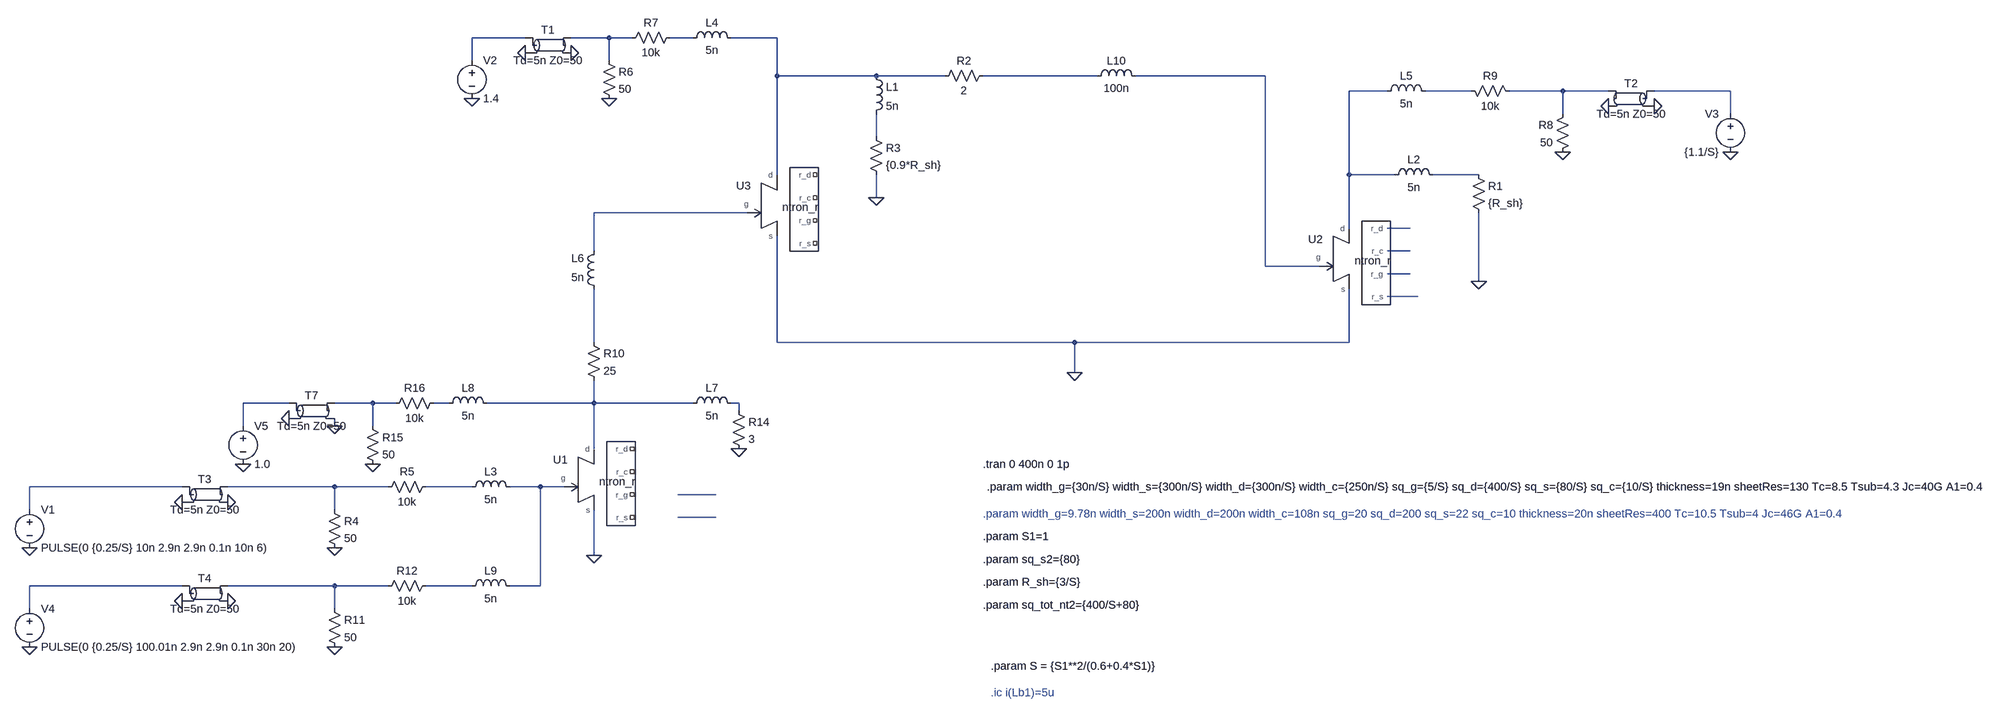
[diagram p0: schematic spiking_network_layer.asc]
spiking_network_layer.asc, the LTspice schematic file:
Version 4
SHEET 1 3684 1400
WIRE -1184 -176 -1296 -176
WIRE -1008 -176 -1088 -176
WIRE -960 -176 -1008 -176
WIRE -832 -176 -880 -176
WIRE -656 -176 -752 -176
WIRE -1296 -128 -1296 -176
WIRE -1008 -128 -1008 -176
WIRE -656 -96 -656 -176
WIRE -416 -96 -656 -96
WIRE -272 -96 -416 -96
WIRE 48 -96 -192 -96
WIRE 400 -96 128 -96
WIRE 656 -64 576 -64
WIRE 832 -64 736 -64
WIRE 1024 -64 912 -64
WIRE 1120 -64 1024 -64
WIRE 1376 -64 1216 -64
WIRE 1024 -16 1024 -64
WIRE 1376 -16 1376 -64
WIRE -416 32 -416 -16
WIRE -656 112 -656 -96
WIRE 576 112 576 -64
WIRE 672 112 576 112
WIRE 848 112 752 112
WIRE -416 160 -416 112
WIRE -720 192 -1040 192
WIRE 576 224 576 112
WIRE 704 224 656 224
WIRE -1040 272 -1040 192
WIRE 704 272 656 272
WIRE 400 304 400 -96
WIRE 512 304 400 304
WIRE 704 320 656 320
WIRE 848 336 848 192
WIRE 720 368 656 368
WIRE -1040 464 -1040 352
WIRE -656 464 -656 240
WIRE 0 464 -656 464
WIRE 576 464 576 352
WIRE 576 464 0 464
WIRE 0 528 0 464
WIRE -1680 592 -1776 592
WIRE -1504 592 -1584 592
WIRE -1456 592 -1504 592
WIRE -1344 592 -1376 592
WIRE -1040 592 -1040 544
WIRE -1040 592 -1264 592
WIRE -832 592 -1040 592
WIRE -736 592 -752 592
WIRE -736 608 -736 592
WIRE -1776 640 -1776 592
WIRE -1584 640 -1584 624
WIRE -1504 640 -1504 592
WIRE -1040 688 -1040 592
WIRE -1904 768 -2224 768
WIRE -1584 768 -1808 768
WIRE -1472 768 -1584 768
WIRE -1296 768 -1392 768
WIRE -1152 768 -1216 768
WIRE -1104 768 -1152 768
WIRE -784 784 -864 784
WIRE -2224 816 -2224 768
WIRE -1584 816 -1584 768
WIRE -784 832 -864 832
WIRE -1040 912 -1040 816
WIRE -1904 976 -2224 976
WIRE -1584 976 -1808 976
WIRE -1472 976 -1584 976
WIRE -1296 976 -1392 976
WIRE -1152 976 -1152 768
WIRE -1152 976 -1216 976
WIRE -2224 1024 -2224 976
WIRE -1584 1024 -1584 976
FLAG 0 528 0
FLAG -416 160 0
FLAG 848 336 0
FLAG -1584 896 0
FLAG -2224 896 0
FLAG -1008 -48 0
FLAG -1088 -144 0
FLAG -1184 -144 0
FLAG -1296 -48 0
FLAG 1024 64 0
FLAG 1120 -32 0
FLAG 1216 -32 0
FLAG 1376 64 0
FLAG -1808 800 0
FLAG -1904 800 0
FLAG -1040 912 0
FLAG -1504 720 0
FLAG -1680 624 0
FLAG -1584 640 0
FLAG -1776 720 0
FLAG -736 688 0
FLAG -1584 1104 0
FLAG -2224 1104 0
FLAG -1808 1008 0
FLAG -1904 1008 0
SYMBOL ntron_r 576 288 R0
WINDOW 39 2 131 Invisible 2
WINDOW 3 50 -11 Top 2
SYMATTR SpiceLine width_g={width_g} width_s={width_s} width_d={width_d} width_c={width_c} sq_g={sq_g} sq_d={sq_tot_nt2-sq_s2} sq_s={sq_s2} sq_c={sq_c} thickness={thickness} sheetRes={sheetRes} Tc={Tc} Tsub={Tsub} Jc={Jc} A1={A1}
SYMATTR InstName U2
SYMBOL res 832 96 R0
SYMATTR InstName R1
SYMATTR Value {R_sh}
SYMBOL res -432 16 R0
SYMATTR InstName R3
SYMATTR Value {0.9*R_sh}
SYMBOL ind -432 -112 R0
SYMATTR InstName L1
SYMATTR Value 5n
SYMBOL ind 656 128 R270
WINDOW 0 32 56 VTop 2
WINDOW 3 5 56 VBottom 2
SYMATTR InstName L2
SYMATTR Value 5n
SYMBOL res -1600 800 R0
SYMATTR InstName R4
SYMATTR Value 50
SYMBOL res -1488 784 R270
WINDOW 0 32 56 VTop 2
WINDOW 3 0 56 VBottom 2
SYMATTR InstName R5
SYMATTR Value 10k
SYMBOL ind -1312 784 R270
WINDOW 0 32 56 VTop 2
WINDOW 3 5 56 VBottom 2
SYMATTR InstName L3
SYMATTR Value 5n
SYMBOL voltage -2224 800 R0
WINDOW 123 0 0 Left 0
WINDOW 39 0 0 Left 0
SYMATTR InstName V1
SYMATTR Value PULSE(0 {0.25/S} 10n 2.9n 2.9n 0.1n 10n 6)
SYMBOL tline -1136 -160 R0
SYMATTR InstName T1
SYMATTR Value Td=5n Z0=50
SYMBOL res -1024 -144 R0
SYMATTR InstName R6
SYMATTR Value 50
SYMBOL res -976 -160 R270
WINDOW 0 32 56 VTop 2
WINDOW 3 0 56 VBottom 2
SYMATTR InstName R7
SYMATTR Value 10k
SYMBOL ind -848 -160 R270
WINDOW 0 32 56 VTop 2
WINDOW 3 5 56 VBottom 2
SYMATTR InstName L4
SYMATTR Value 5n
SYMBOL voltage -1296 -144 R0
WINDOW 123 0 0 Left 0
WINDOW 39 0 0 Left 0
SYMATTR InstName V2
SYMATTR Value 1.4
SYMBOL tline 1168 -48 M0
SYMATTR InstName T2
SYMATTR Value Td=5n Z0=50
SYMBOL res 1040 -32 M0
SYMATTR InstName R8
SYMATTR Value 50
SYMBOL res 928 -48 M270
WINDOW 0 32 56 VTop 2
WINDOW 3 0 56 VBottom 2
SYMATTR InstName R9
SYMATTR Value 10k
SYMBOL ind 752 -48 M270
WINDOW 0 32 56 VTop 2
WINDOW 3 5 56 VBottom 2
SYMATTR InstName L5
SYMATTR Value 5n
SYMBOL voltage 1376 -32 M0
WINDOW 123 0 0 Left 0
WINDOW 39 0 0 Left 0
SYMATTR InstName V3
SYMATTR Value {1.1/S}
SYMBOL tline -1856 784 R0
SYMATTR InstName T3
SYMATTR Value Td=5n Z0=50
SYMBOL res -288 -80 R270
WINDOW 0 32 56 VTop 2
WINDOW 3 0 56 VBottom 2
SYMATTR InstName R2
SYMATTR Value 2
SYMBOL ntron_r -656 176 R0
WINDOW 39 2 131 Invisible 2
WINDOW 3 50 -11 Top 2
SYMATTR SpiceLine width_g={width_g} width_s={width_s} width_d={width_d} width_c={width_c} sq_g=10 sq_d={sq_d} sq_s={sq_s} sq_c={sq_c} thickness={thickness} sheetRes={sheetRes} Tc={Tc} Tsub={Tsub} Jc={Jc} A1={A1}
SYMATTR InstName U3
SYMBOL res -752 592 R0
SYMATTR InstName R14
SYMATTR Value 3
SYMBOL ind -848 608 R270
WINDOW 0 32 56 VTop 2
WINDOW 3 5 56 VBottom 2
SYMATTR InstName L7
SYMATTR Value 5n
SYMBOL ntron_r -1040 752 R0
WINDOW 39 2 131 Invisible 2
WINDOW 3 50 -11 Top 2
SYMATTR SpiceLine width_g={0.8*width_g} width_s={width_s} width_d={width_d} width_c={width_c} sq_g=10 sq_d={sq_d} sq_s={sq_s} sq_c={sq_c} thickness={thickness} sheetRes={sheetRes} Tc={Tc} Tsub={Tsub} Jc={Jc} A1={A1}
SYMATTR InstName U1
SYMBOL tline -1632 608 R0
SYMATTR InstName T7
SYMATTR Value Td=5n Z0=50
SYMBOL res -1520 624 R0
SYMATTR InstName R15
SYMATTR Value 50
SYMBOL res -1472 608 R270
WINDOW 0 32 56 VTop 2
WINDOW 3 0 56 VBottom 2
SYMATTR InstName R16
SYMATTR Value 10k
SYMBOL ind -1360 608 R270
WINDOW 0 32 56 VTop 2
WINDOW 3 5 56 VBottom 2
SYMATTR InstName L8
SYMATTR Value 5n
SYMBOL voltage -1776 624 R0
WINDOW 123 0 0 Left 0
WINDOW 39 0 0 Left 0
SYMATTR InstName V5
SYMATTR Value 1.0
SYMBOL res -1056 448 R0
SYMATTR InstName R10
SYMATTR Value 25
SYMBOL ind -1024 368 R180
WINDOW 0 36 80 Left 2
WINDOW 3 36 40 Left 2
SYMATTR InstName L6
SYMATTR Value 5n
SYMBOL res -1600 1008 R0
SYMATTR InstName R11
SYMATTR Value 50
SYMBOL res -1488 992 R270
WINDOW 0 32 56 VTop 2
WINDOW 3 0 56 VBottom 2
SYMATTR InstName R12
SYMATTR Value 10k
SYMBOL ind -1312 992 R270
WINDOW 0 32 56 VTop 2
WINDOW 3 5 56 VBottom 2
SYMATTR InstName L9
SYMATTR Value 5n
SYMBOL voltage -2224 1008 R0
WINDOW 123 0 0 Left 0
WINDOW 39 0 0 Left 0
SYMATTR InstName V4
SYMATTR Value PULSE(0 {0.25/S} 100.01n 2.9n 2.9n 0.1n 30n 20)
SYMBOL tline -1856 992 R0
SYMATTR InstName T4
SYMATTR Value Td=5n Z0=50
SYMBOL ind 32 -80 R270
WINDOW 0 32 56 VTop 2
WINDOW 3 5 56 VBottom 2
SYMATTR InstName L10
SYMATTR Value 100n
TEXT -192 720 Left 2 !.tran 0 400n 0 1p
TEXT -176 1200 Left 2 ;.ic i(Lb1)=5u
TEXT -184 768 Left 2 !.param width_g={30n/S} width_s={300n/S} width_d={300n/S} width_c={250n/S} sq_g={5/S} sq_d={400/S} sq_s={80/S} sq_c={10/S} thickness=19n sheetRes=130 Tc=8.5 Tsub=4.3 Jc=40G A1=0.4
TEXT -192 968 Left 2 !.param R_sh={3/S}
TEXT -192 824 Left 2 ;.param width_g=9.78n width_s=200n width_d=200n width_c=108n sq_g=20 sq_d=200 sq_s=22 sq_c=10 thickness=20n sheetRes=400 Tc=10.5 Tsub=4 Jc=46G A1=0.4
TEXT -192 920 Left 2 !.param sq_s2={80}
TEXT -192 1016 Left 2 !.param sq_tot_nt2={400/S+80}
TEXT -192 872 Left 2 !.param S1=1
TEXT -176 1144 Left 2 !.param S = {S1**2/(0.6+0.4*S1)}

The netlist it stands for:
* spiking_network_layer.asc
XU2 N006 N007 0 N016 N014 N015 N017 ntron_r ntron_r width_g={width_g} width_s={width_s} width_d={width_d} width_c={width_c} sq_g={sq_g} sq_d={sq_tot_nt2-sq_s2} sq_s={sq_s2} sq_c={sq_c} thickness={thickness} sheetRes={sheetRes} Tc={Tc} Tsub={Tsub} Jc={Jc} A1={A1}  ; pins g d s r_g r_d r_c r_s
R1 N012 0 {R_sh}
R3 N011 0 {0.9*R_sh}
L1 N004 N011 5n
L2 N007 N012 5n
R4 N025 0 50
R5 N025 N026 10k
L3 N026 N027 5n
V1 N024 0 PULSE(0 {0.25/S} 10n 2.9n 2.9n 0.1n 10n 6)
T1 N001 0 N002 0 Td=5n Z0=50
R6 N002 0 50
R7 N002 N003 10k
L4 N003 N004 5n
V2 N001 0 1.4
T2 N010 0 N009 0 Td=5n Z0=50
R8 N009 0 50
R9 N009 N008 10k
L5 N008 N007 5n
V3 N010 0 {1.1/S}
T3 N024 0 N025 0 Td=5n Z0=50
R2 N004 N005 2
XU3 N013 N004 0 NC_01 NC_02 NC_03 NC_04 ntron_r ntron_r width_g={width_g} width_s={width_s} width_d={width_d} width_c={width_c} sq_g=10 sq_d={sq_d} sq_s={sq_s} sq_c={sq_c} thickness={thickness} sheetRes={sheetRes} Tc={Tc} Tsub={Tsub} Jc={Jc} A1={A1}  ; pins g d s r_g r_d r_c r_s
R14 N023 0 3
L7 N022 N023 5n
XU1 N027 N022 0 NC_05 NC_06 NC_07 NC_08 ntron_r ntron_r width_g={0.8*width_g} width_s={width_s} width_d={width_d} width_c={width_c} sq_g=10 sq_d={sq_d} sq_s={sq_s} sq_c={sq_c} thickness={thickness} sheetRes={sheetRes} Tc={Tc} Tsub={Tsub} Jc={Jc} A1={A1}  ; pins g d s r_g r_d r_c r_s
T7 N019 0 N020 0 Td=5n Z0=50
R15 N020 0 50
R16 N020 N021 10k
L8 N021 N022 5n
V5 N019 0 1.0
R10 N018 N022 25
L6 N018 N013 5n
R11 N031 0 50
R12 N031 N032 10k
L9 N032 N027 5n
V4 N030 0 PULSE(0 {0.25/S} 100.01n 2.9n 2.9n 0.1n 30n 20)
T4 N030 0 N031 0 Td=5n Z0=50
L10 N005 N006 100n
.tran 0 400n 0 1p
* .ic i(Lb1)=5u
.param width_g={30n/S} width_s={300n/S} width_d={300n/S} width_c={250n/S} sq_g={5/S} sq_d={400/S} sq_s={80/S} sq_c={10/S} thickness=19n sheetRes=130 Tc=8.5 Tsub=4.3 Jc=40G A1=0.4
.param R_sh={3/S}
* .param width_g=9.78n width_s=200n width_d=200n width_c=108n sq_g=20 sq_d=200 sq_s=22 sq_c=10 thickness=20n sheetRes=400 Tc=10.5 Tsub=4 Jc=46G A1=0.4
.param sq_s2={80}
.param sq_tot_nt2={400/S+80}
.param S1=1
.param S = {S1**2/(0.6+0.4*S1)}
.lib ntron_2.lib
.backanno
.end